# Altium project Med_Prj_ECG.PrjPcb (part 1 of 5)
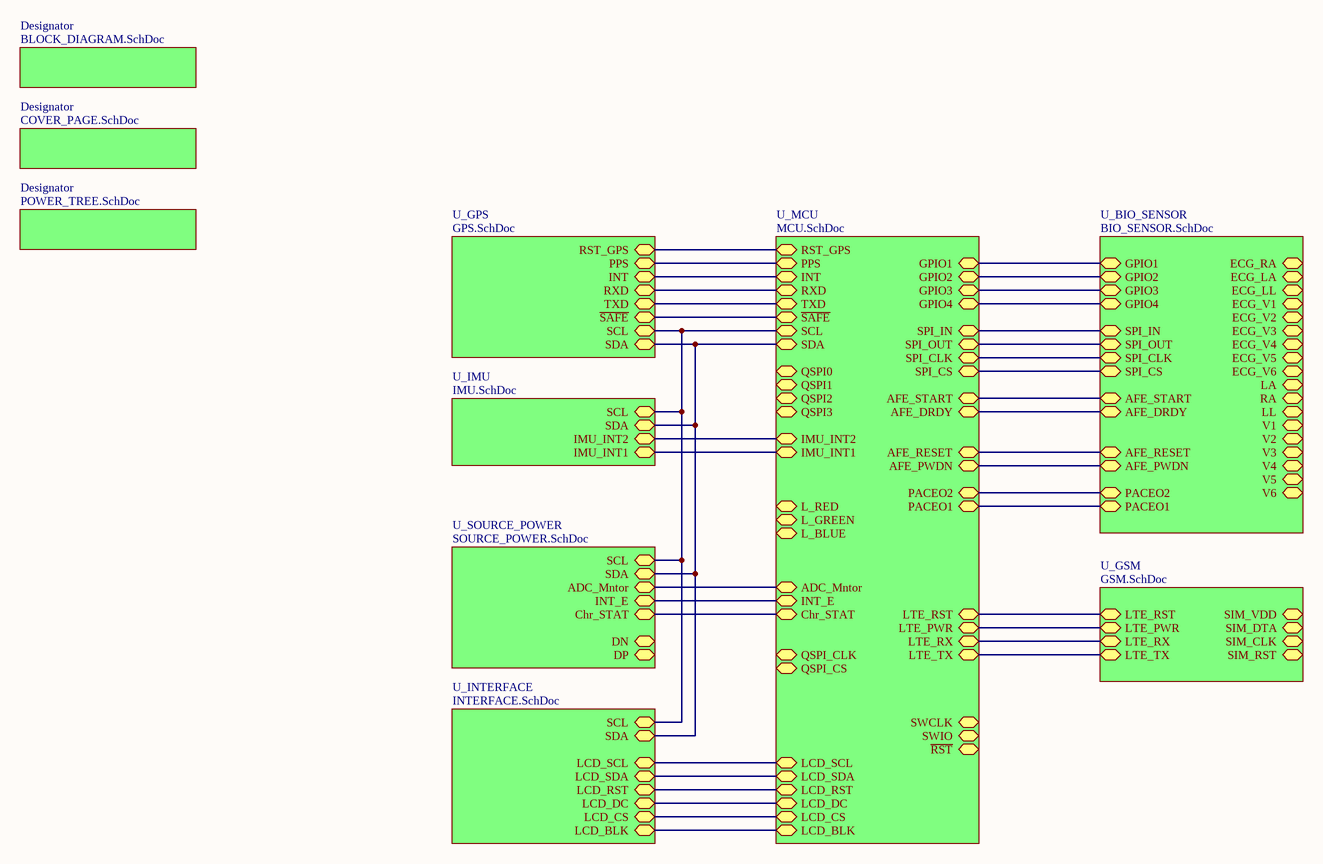
[diagram p0: LINK__PAGE.SchDoc]
12 sheets, 251 parts. Net scope: flat (ports and power ports of the same name join across sheets).
Board files: ECG_Prj_PCB v1.0.PcbDoc, ECG_Prj_PCB_v2.0.PcbDoc
Sheets:
  LINK__PAGE.SchDoc
    Designator = COVER_PAGE.SchDoc
    Designator = BLOCK_DIAGRAM.SchDoc
    U_IMU = IMU.SchDoc
    U_SOURCE_POWER = SOURCE_POWER.SchDoc
    U_GPS = GPS.SchDoc
    U_BIO_SENSOR = BIO_SENSOR.SchDoc
    U_INTERFACE = INTERFACE.SchDoc
    U_MCU = MCU.SchDoc
    Designator = POWER_TREE.SchDoc
    U_GSM = GSM.SchDoc
  Sheet1.SchDoc

## Sheet LINK__PAGE.SchDoc
size A3; SheetNumber: 1; SheetTotal: 12

### Sub-sheets
Designator = COVER_PAGE.SchDoc: no entries
Designator = BLOCK_DIAGRAM.SchDoc: no entries
Designator = POWER_TREE.SchDoc: no entries
U_BIO_SENSOR = BIO_SENSOR.SchDoc: GPIO1 (bidir), GPIO2 (bidir), GPIO3 (bidir), GPIO4 (bidir), AFE_DRDY (bidir), SPI_IN (bidir), SPI_OUT (bidir), SPI_CLK (bidir), SPI_CS (bidir), AFE_START (bidir), AFE_RESET (bidir), AFE_PWDN (bidir), ECG_RA (bidir), ECG_LA (bidir), ECG_LL (bidir), ECG_V1 (bidir), ECG_V2 (bidir), ECG_V3 (bidir), ECG_V4 (bidir), ECG_V5 (bidir), ECG_V6 (bidir), V6 (bidir), LA (bidir), LL (bidir), RA (bidir), V1 (bidir), V5 (bidir), V4 (bidir), V2 (bidir), V3 (bidir), PACEO2 (bidir), PACEO1 (bidir)
U_GPS = GPS.SchDoc: SDA (bidir), SCL (bidir), ~{SAFE} (bidir), TXD (bidir), RXD (bidir), INT (bidir), PPS (bidir), RST_GPS (bidir)
U_GSM = GSM.SchDoc: LTE_RST (bidir), LTE_PWR (bidir), LTE_RX (bidir), LTE_TX (bidir), SIM_DTA (bidir), SIM_VDD (bidir), SIM_CLK (bidir), SIM_RST (bidir)
U_IMU = IMU.SchDoc: IMU_INT1 (bidir), IMU_INT2 (bidir), SDA (bidir), SCL (bidir)
U_INTERFACE = INTERFACE.SchDoc: LCD_BLK (bidir), LCD_CS (bidir), LCD_DC (bidir), LCD_RST (bidir), LCD_SDA (bidir), LCD_SCL (bidir), SDA (bidir), SCL (bidir)
U_MCU = MCU.SchDoc: QSPI1 (bidir), QSPI_CLK (bidir), QSPI0 (bidir), QSPI_CS (bidir), QSPI2 (bidir), QSPI3 (bidir), L_BLUE (bidir), L_RED (bidir), SPI_IN (bidir), SPI_OUT (bidir), SPI_CLK (bidir), AFE_START (bidir), SPI_CS (bidir), GPIO1 (bidir), GPIO2 (bidir), GPIO3 (bidir), GPIO4 (bidir), PACEO2 (bidir), PACEO1 (bidir), AFE_DRDY (bidir), Chr_STAT (bidir), SCL (bidir), SDA (bidir), INT_E (bidir), ADC_Mntor (bidir), L_GREEN (bidir), ~{SAFE} (bidir), TXD (bidir), RXD (bidir), INT (bidir), PPS (bidir), IMU_INT1 (bidir), IMU_INT2 (bidir), SWCLK (bidir), SWIO (bidir), ~{RST} (bidir), LCD_BLK (bidir), LCD_CS (bidir), LCD_DC (bidir), LCD_RST (bidir), LCD_SDA (bidir), LCD_SCL (bidir), RST_GPS (bidir), AFE_RESET (bidir), AFE_PWDN (bidir), LTE_RST (bidir), LTE_PWR (bidir), LTE_RX (bidir), LTE_TX (bidir)
U_SOURCE_POWER = SOURCE_POWER.SchDoc: DP (bidir), DN (bidir), Chr_STAT (bidir), SCL (bidir), SDA (bidir), INT_E (bidir), ADC_Mntor (bidir)

### Nets
(unnamed): sheet U_IMU/IMU_INT1, sheet U_MCU/IMU_INT1
(unnamed): sheet U_IMU/IMU_INT2, sheet U_MCU/IMU_INT2
(unnamed): sheet U_IMU/SDA, sheet U_SOURCE_POWER/SDA, sheet U_GPS/SDA, sheet U_INTERFACE/SDA, sheet U_MCU/SDA
(unnamed): sheet U_IMU/SCL, sheet U_SOURCE_POWER/SCL, sheet U_GPS/SCL, sheet U_INTERFACE/SCL, sheet U_MCU/SCL
(unnamed): sheet U_SOURCE_POWER/Chr_STAT, sheet U_MCU/Chr_STAT
(unnamed): sheet U_SOURCE_POWER/INT_E, sheet U_MCU/INT_E
(unnamed): sheet U_SOURCE_POWER/ADC_Mntor, sheet U_MCU/ADC_Mntor
(unnamed): sheet U_GPS/~{SAFE}, sheet U_MCU/~{SAFE}
(unnamed): sheet U_GPS/TXD, sheet U_MCU/TXD
(unnamed): sheet U_GPS/RXD, sheet U_MCU/RXD
(unnamed): sheet U_GPS/INT, sheet U_MCU/INT
(unnamed): sheet U_GPS/PPS, sheet U_MCU/PPS
(unnamed): sheet U_GPS/RST_GPS, sheet U_MCU/RST_GPS
(unnamed): sheet U_BIO_SENSOR/GPIO1, sheet U_MCU/GPIO1
(unnamed): sheet U_BIO_SENSOR/GPIO2, sheet U_MCU/GPIO2
(unnamed): sheet U_BIO_SENSOR/GPIO3, sheet U_MCU/GPIO3
(unnamed): sheet U_BIO_SENSOR/GPIO4, sheet U_MCU/GPIO4
(unnamed): sheet U_BIO_SENSOR/AFE_DRDY, sheet U_MCU/AFE_DRDY
(unnamed): sheet U_BIO_SENSOR/SPI_IN, sheet U_MCU/SPI_IN
(unnamed): sheet U_BIO_SENSOR/SPI_OUT, sheet U_MCU/SPI_OUT
(unnamed): sheet U_BIO_SENSOR/SPI_CLK, sheet U_MCU/SPI_CLK
(unnamed): sheet U_BIO_SENSOR/SPI_CS, sheet U_MCU/SPI_CS
(unnamed): sheet U_BIO_SENSOR/AFE_START, sheet U_MCU/AFE_START
(unnamed): sheet U_BIO_SENSOR/AFE_RESET, sheet U_MCU/AFE_RESET
(unnamed): sheet U_BIO_SENSOR/AFE_PWDN, sheet U_MCU/AFE_PWDN
(unnamed): sheet U_BIO_SENSOR/PACEO2, sheet U_MCU/PACEO2
(unnamed): sheet U_BIO_SENSOR/PACEO1, sheet U_MCU/PACEO1
(unnamed): sheet U_INTERFACE/LCD_BLK, sheet U_MCU/LCD_BLK
(unnamed): sheet U_INTERFACE/LCD_CS, sheet U_MCU/LCD_CS
(unnamed): sheet U_INTERFACE/LCD_DC, sheet U_MCU/LCD_DC
(unnamed): sheet U_INTERFACE/LCD_RST, sheet U_MCU/LCD_RST
(unnamed): sheet U_INTERFACE/LCD_SDA, sheet U_MCU/LCD_SDA
(unnamed): sheet U_INTERFACE/LCD_SCL, sheet U_MCU/LCD_SCL
(unnamed): sheet U_MCU/LTE_RST, sheet U_GSM/LTE_RST
(unnamed): sheet U_MCU/LTE_PWR, sheet U_GSM/LTE_PWR
(unnamed): sheet U_MCU/LTE_RX, sheet U_GSM/LTE_RX
(unnamed): sheet U_MCU/LTE_TX, sheet U_GSM/LTE_TX

## Sheet COVER_PAGE.SchDoc
size A4; SheetNumber: 2; SheetTotal: 11
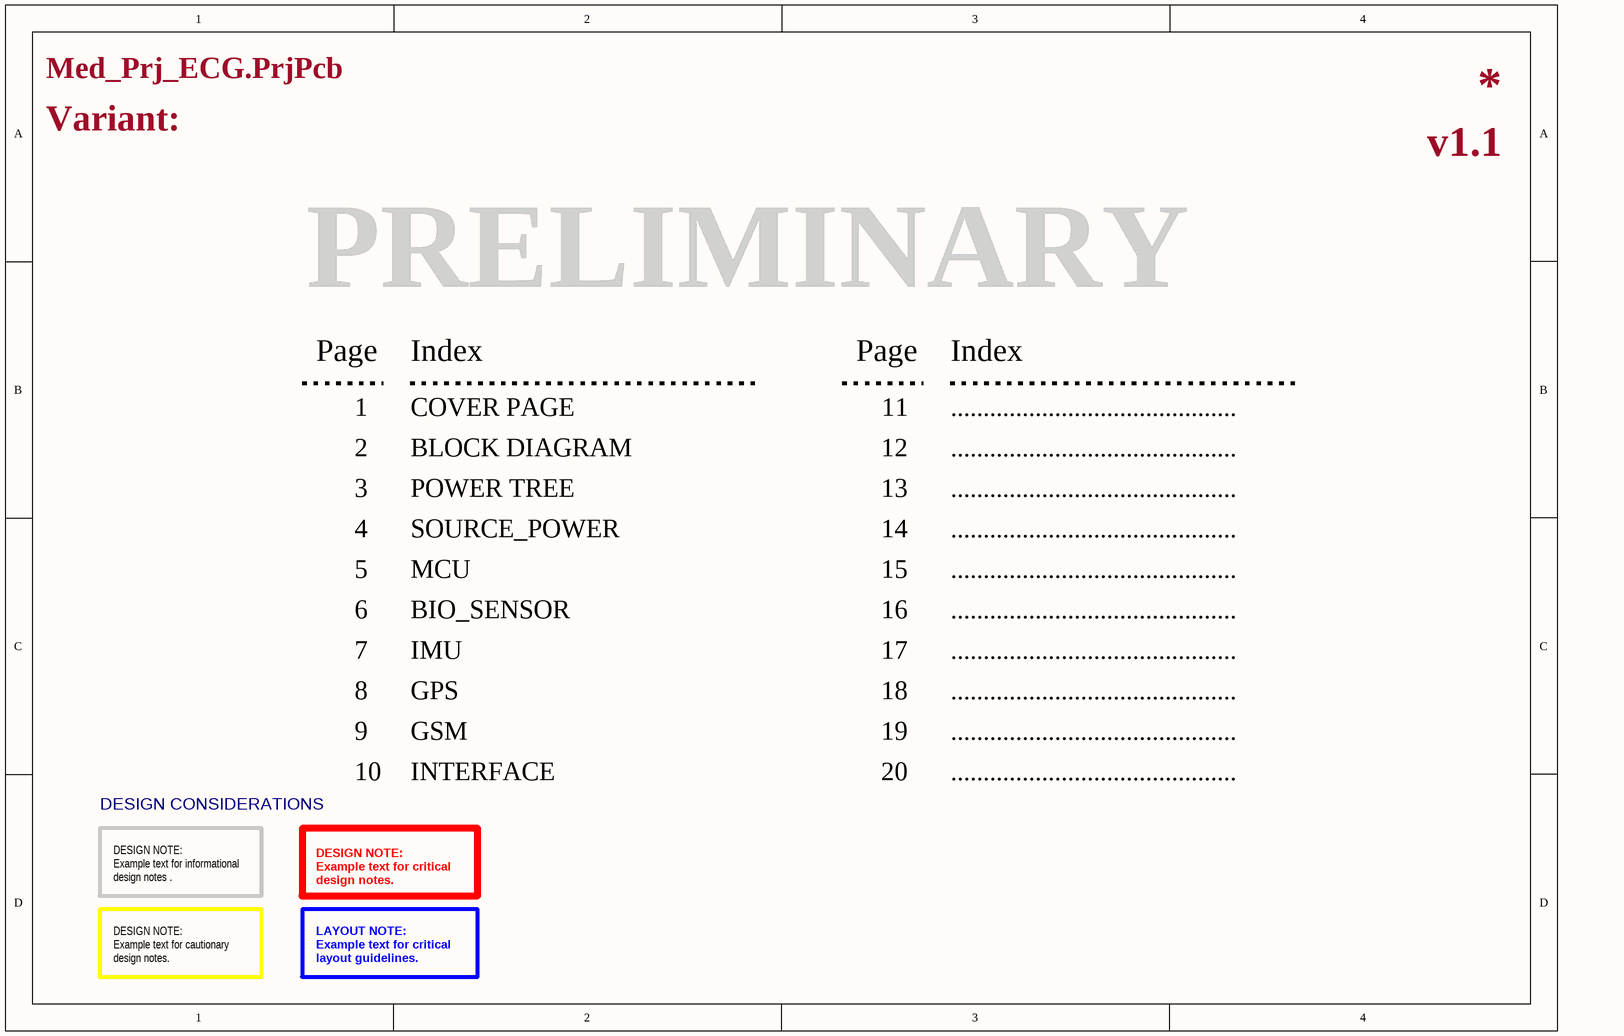
[diagram p1: COVER_PAGE.SchDoc]

### Notes on the sheet
- Variant:
- v1.1
- PRELIMINARY
- Page
- Index
- 1
- COVER PAGE
- 11
- ............................................
- 2
- 3
- BLOCK DIAGRAM
- POWER TREE
- 12
- 13
- 4
- 5
- SOURCE_POWER
- MCU
- 14
- 15
- 6
- BIO_SENSOR
- 16
- 7
- 8
- GPS
- IMU
- 17
- 18
- 9
- 10
- GSM
- INTERFACE
- 19
- 20
- DESIGN CONSIDERATIONS
- DESIGN NOTE:
  Example text for informational
  design notes .
- DESIGN NOTE:
  Example text for critical
  design notes.
- DESIGN NOTE:
  Example text for cautionary
  design notes.
- LAYOUT NOTE:
  Example text for critical
  layout guidelines.

## Sheet BLOCK_DIAGRAM.SchDoc
size A; SheetNumber: 3; SheetTotal: 10
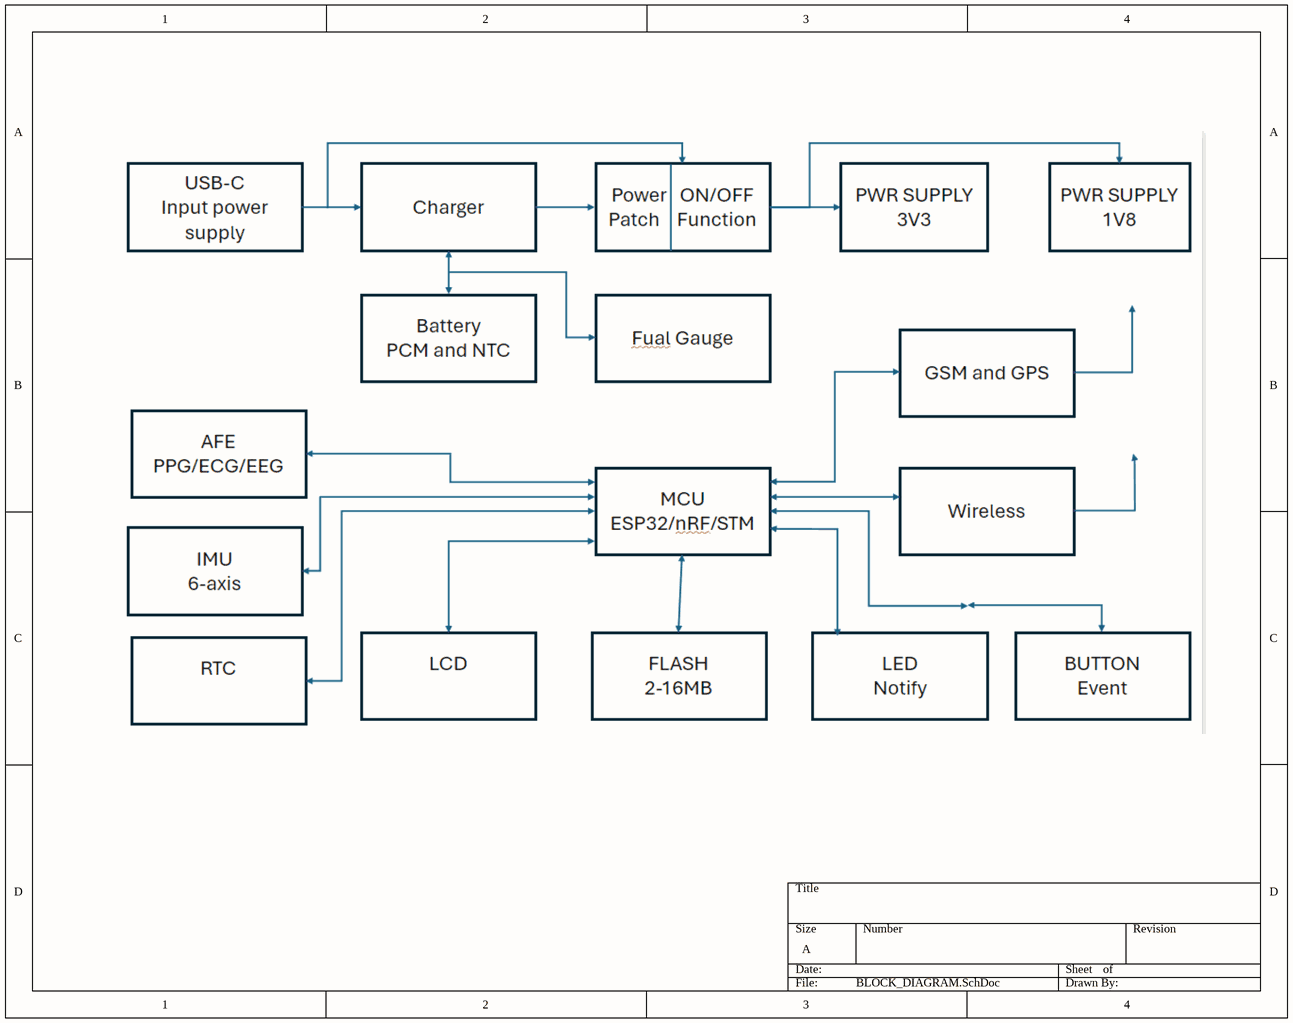
[diagram p2: BLOCK_DIAGRAM.SchDoc]

## Sheet IMU.SchDoc
size A; SheetNumber: 8; SheetTotal: 12
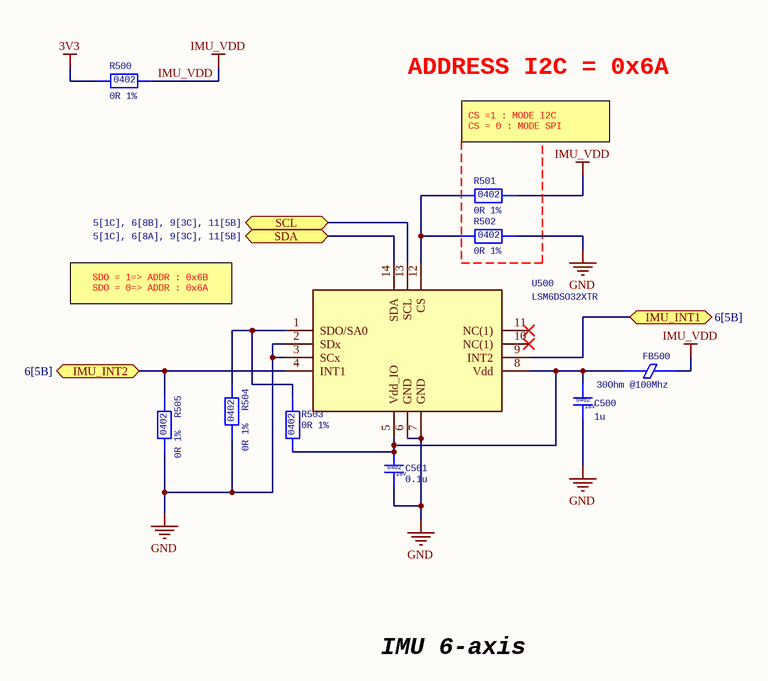
[diagram p3: IMU.SchDoc]

### Parts
C500  1u  [CAP0402]
C501  0.1u  [CAP0402]
FB500  30Ohm @100Mhz  [FB0402]
R500  0R 1%  [RES0402]
R501  0R 1%  [RES0402]
R502  0R 1%  [RES0402]
R503  0R 1%  [RES0402]
R504  0R 1%  [RES0402]
R505  0R 1%  [RES0402]
U500  LSM6DSO32XTR  [LSM6DSO32XTR]

### Ports
IMU_INT1 (bidir, see 6[5B]), IMU_INT2 (bidir, see 6[5B]), SCL (bidir, see 5[1C], 6[8B], 9[3C], 11[5B]), SDA (bidir, see 5[1C], 6[8A], 9[3C], 11[5B])

### Nets
3V3: R500.1
GND: C500.2 C501.2 R502.2 R504.1 R505.1 U500.2(SDx) U500.3(SCx) U500.6(GND) U500.7(GND)
IMU_VDD: FB500.2 R500.2 R501.2
P0.10: U500.9(INT2) ; port IMU_INT1
P0.12: R505.2 U500.4(INT1) ; port IMU_INT2
P1.02: U500.14(SDA) ; port SDA
P1.03: U500.13(SCL) ; port SCL
NetC500_1: C500.1 C501.1 FB500.1 R503.1 U500.5(Vdd_IO) U500.8(Vdd)
NetR501_1: R501.1 R502.1 U500.12(CS)
NetR503_2: R503.2 R504.2 U500.1(SDO/SA0)

Not connected (* = marked no-connect by the designer): U500 10(NC(1))* 11(NC(1))*

### Notes on the sheet
- ADDRESS I2C = 0x6A
- CS =1 : MODE I2C
  CS = 0 : MODE SPI
- SDO = 1=> ADDR : 0x6B
  SDO = 0=> ADDR : 0x6A
- IMU 6-axis

### Library data of the parts
C500 = C_0402_1u: Ceramic Capacitor, Multilayer, Ceramic, 16V, 10% +Tol, 10% -Tol, X5R, 15% TC, 1uF, Surface Mount, 0402; Manufacturer: Taiyo Yuden; Manufacturer Part Number: EMK105BJ105KV-F; Multilayer: Yes; Supplier: Digikey; Supplier Part Number: 587-2477-1-ND; RoHS: Yes; Category: Ceramic Capacitors; Stock: 2709915; Pricing: 1=0.1, 10=0.045, 50=0.031, 100=0.0266, 500=0.01912, 1000=0.01682, 2500=0.01437, 5000=0.01289 (USD); Mounting Technology: Surface Mount; Pins: 2; Dielectric Material: Ceramic; Package Shape: Rectangular; Case/Package: 0402; Terminal Finish: Nickel; Min Operating Temperature: -55°C; Max Operating Temperature: 85°C; JESD-609 Code: e3; Value: 1uF; Capacitor Type: Ceramic; Tolerance  (fill in as +-): 10%; Package Style: SMTMeter; Packaging: Tape and Reel; Tolerance (fill in as +-): 10%; Rated DC Voltage (URdc): 16V; Temperature Characteristics Code: X5R; Termination: Wraparound; Length: 1mm; Width: 0.5mm; Height: 0.5mm; Reach SVHC Compliant: Yes; RoHS Compliant: Yes; ComponentLink1URL: https://datasheet.ciiva.com:443/pdfs/VipMasterIC/IC/TAIY/TAIY-S-A0009096450/TAIY-S-A0009096597-1.pdf?src-supplier=IHS+Markit; ComponentLink1Description: https://datasheet.ciiva.com:443/pdfs/VipMasterIC/IC/TAIY/TAIY-S-A0009096450/TAIY-S-A0009096597-1.pdf?src-supplier=IHS+Markit; ComponentLink2URL: https://datasheet.ciiva.com/134/emk105bj105kv-f-ss-134209.pdf?src-supplier=Digikey; ComponentLink2Description: https://datasheet.ciiva.com/134/emk105bj105kv-f-ss-134209.pdf?src-supplier=Digikey; ComponentLink3URL: https://datasheet.ciiva.com/15920/964emk105bj105kv-f-15920402.pdf?src-supplier=Onlinecomponents.com; ComponentLink3Description: https://datasheet.ciiva.com/15920/964emk105bj105kv-f-15920402.pdf?src-supplier=Onlinecomponents.com; ComponentLink4URL: https://datasheet.ciiva.com/26871/getdatasheetpartid-638287-26871289.pdf?src-supplier=Verical; ComponentLink4Description: https://datasheet.ciiva.com/26871/getdatasheetpartid-638287-26871289.pdf?src-supplier=Verical; ComponentLink5URL: https://datasheet.ciiva.com/30259/265emk105bj105kv-f-30259872.pdf?src-supplier=Onlinecomponents.com; ComponentLink5Description: https://datasheet.ciiva.com/30259/265emk105bj105kv-f-30259872.pdf?src-supplier=Onlinecomponents.com; ComponentLink6URL: https://datasheet.ciiva.com/7657/1497285-7657320.pdf?src-supplier=Element14; ComponentLink6Description: https://datasheet.ciiva.com/7657/1497285-7657320.pdf?src-supplier=Element14; ComponentLink7URL: https://datasheet.ciiva.com/22694/1497285-22694239.pdf?src-supplier=Element14; ComponentLink7Description: https://datasheet.ciiva.com/22694/1497285-22694239.pdf?src-supplier=Element14; ComponentLink8URL: https://datasheet.ciiva.com/5424/mlcc01-e-5424190.pdf?src-supplier=Mouser; ComponentLink8Description: https://datasheet.ciiva.com/5424/mlcc01-e-5424190.pdf?src-supplier=Mouser
C501 = C_0402_0.1u: Ceramic Capacitor, Multilayer, Ceramic, 16V, 10% +Tol, 10% -Tol, X7R, 15% TC, 0.1uF, Surface Mount, 0402; Manufacturer: Murata; Manufacturer Part Number: GRM155R71C104KA88J; Value: 100nF; Multilayer: Yes; Supplier: Digikey; Supplier Part Number: 490-6328-1-ND; RoHS: Yes; Category: Ceramic Capacitors; Stock: 19409569; Pricing: 1=0.1, 10=0.019, 50=0.011, 100=0.0086, 500=0.00646, 1000=0.00508, 2500=0.00462, 5000=0.00425 (USD); Mounting Technology: Surface Mount; Pins: 2; Dielectric Material: Ceramic; Package Shape: Rectangular; Case/Package: 0402; Terminal Finish: Nickel; Min Operating Temperature: -55°C; Max Operating Temperature: 125°C; JESD-609 Code: e3; Capacitor Type: Ceramic; Tolerance  (fill in as +-): 10%; Package Style: SMTMeter; Packaging: Tape and Reel; Tolerance (fill in as +-): 10%; Rated DC Voltage (URdc): 16V; Temperature Characteristics Code: X7R; Termination: Wraparound; Length: 1mm; Width: 0.5mm; Height: 0.5mm; Reach SVHC Compliant: Yes; RoHS Compliant: Yes; ComponentLink1URL: https://psearch.en.murata.com:443/capacitor/product/GRM155R71C104KA88%23.pdf?src-supplier=IHS+Markit; ComponentLink1Description: https://psearch.en.murata.com:443/capacitor/product/GRM155R71C104KA88%23.pdf?src-supplier=IHS+Markit; ComponentLink2URL: https://datasheet.ciiva.com/6271/product-6271168.pdf?src-supplier=Digikey; ComponentLink2Description: https://datasheet.ciiva.com/6271/product-6271168.pdf?src-supplier=Digikey; ComponentLink3URL: https://datasheet.ciiva.com/6271/grm155r71c104ka88-01-6271231.pdf?src-supplier=Digikey; ComponentLink3Description: https://datasheet.ciiva.com/6271/grm155r71c104ka88-01-6271231.pdf?src-supplier=Digikey
FB500 = BLM15PD300SN1D: Ferrite Chip, 1 Function(s), 1.4A, 2 Pin(s); Manufacturer: Murata; DC Resistance-Max: 35mR; Clock Frequency: 100MHz; Channels: 1; Output Impedance: 30R; Supplier 1: Digikey; Supplier Part Number 1: 490-5200-1-ND; Supplier: Digikey; Supplier Part Number: 490-5200-6-ND; Manufacturer Part Number: BLM15PD300SN1D; RoHS: Yes; Category: Ferrite Beads and Chips; Stock: 1685; Pricing: 1=0.1, 10=0.054, 25=0.0468, 50=0.042, 100=0.0376, 250=0.03236, 500=0.02884, 1000=0.02561, 5000=0.01905 (USD); Mounting Technology: Surface Mount; Material: Ferrite; Case Code: 0402; Terminal Finish: Tin; Min Operating Temperature: -55°C; Max Operating Temperature: 125°C; JESD-609 Code: e3; Construction: Chip Bead; Filter Type: FERRITE CHIP; Min Frequency: 100MHz; Packaging: Tape and Reel; Current Rating: 1.4A; Length: 1mm; Width: 0.5mm; Height: 0.5mm; Reach SVHC Compliant: Yes; RoHS Compliant: Yes; ComponentLink1URL: https://datasheet.ciiva.com:443/pdfs/VipMasterIC/IC/MURE/MURE-S-A0010009827/MURE-S-A0010009827-1.pdf?src-supplier=IHS+Markit; ComponentLink1Description: https://datasheet.ciiva.com:443/pdfs/VipMasterIC/IC/MURE/MURE-S-A0010009827/MURE-S-A0010009827-1.pdf?src-supplier=IHS+Markit; ComponentLink2URL: https://datasheet.ciiva.com/3854/l0110s0100blm15p-3854117.pdf?src-supplier=Arrow+Electronics; ComponentLink2Description: https://datasheet.ciiva.com/3854/l0110s0100blm15p-3854117.pdf?src-supplier=Arrow+Electronics; ComponentLink3URL: https://datasheet.ciiva.com/18093/getdatasheetpartid-150173-18093043.pdf?src-supplier=Verical; ComponentLink3Description: https://datasheet.ciiva.com/18093/getdatasheetpartid-150173-18093043.pdf?src-supplier=Verical; ComponentLink4URL: https://datasheet.ciiva.com/41425/001171687-da-01-en-chip-drossel0402-30r-2200ma-1-0x0-5mm-41425790.pdf?src-supplier=Conrad; ComponentLink4Description: https://datasheet.ciiva.com/41425/001171687-da-01-en-chip-drossel0402-30r-2200ma-1-0x0-5mm-41425790.pdf?src-supplier=Conrad; ComponentLink5URL: https://datasheet.ciiva.com/41449/001172206-da-01-en-drossel-0402-30r-21-0x0-5mm-10000st-41449493.pdf?src-supplier=Conrad; ComponentLink5Description: https://datasheet.ciiva.com/41449/001172206-da-01-en-drossel-0402-30r-21-0x0-5mm-10000st-41449493.pdf?src-supplier=Conrad; ComponentLink6URL: https://datasheet.ciiva.com/14122/blm-series-eng-tds-14122923.pdf?src-supplier=Distrelec; ComponentLink6Description: https://datasheet.ciiva.com/14122/blm-series-eng-tds-14122923.pdf?src-supplier=Distrelec; ComponentLink7URL: https://datasheet.ciiva.com/1012/l0110e-1012431.pdf?src-supplier=Digikey; ComponentLink7Description: https://datasheet.ciiva.com/1012/l0110e-1012431.pdf?src-supplier=Digikey; ComponentLink8URL: https://datasheet.ciiva.com/1012/l0110e-1012432.pdf?src-supplier=Digikey; ComponentLink8Description: https://datasheet.ciiva.com/1012/l0110e-1012432.pdf?src-supplier=Digikey; ComponentLink9URL: https://datasheet.ciiva.com/1012/l0110e-1012433.pdf?src-supplier=Digikey; ComponentLink9Description: https://datasheet.ciiva.com/1012/l0110e-1012433.pdf?src-supplier=Digikey
R500-R505 = R_0402_0R: Metal Glaze/thick Film, 0.0625W, 0ohm, Surface Mount, 0402; Manufacturer: Yageo; Manufacturer Part Number: RC0402JR-070RL; Power: 62.5mW; Rated Temperature: 70°C; Package Height: 0.35mm; Package Length: 1mm; Package Width: 0.5mm; Supplier 1: Digikey; Supplier Part Number 1: 311-0.0JRTR-ND; Supplier: Digikey; Supplier Part Number: 311-0.0JRCT-ND; RoHS: Yes; Category: Chip SMD Resistors; Stock: 14877447; Pricing: 1=0.1, 10=0.011, 25=0.0084, 50=0.0064, 100=0.0045, 250=0.00364, 500=0.0029, 1000=0.00214, 5000=0.00154, 10000=0.00133, 30000=0.00117, 50000=0.00107, 100000=0.00105 (USD); Mounting Technology: Surface Mount; Pins: 2; Package Shape: Rectangular; Case/Package: 0402; Terminal Finish: Nickel; Min Operating Temperature: -55°C; Max Operating Temperature: 155°C; JESD-609 Code: e3; Resistor Type: FIXED RESISTOR; Packaging: Tape and Reel; Value: 0R; Technology: METAL GLAZE/THICK FILM; Termination: Wraparound; Construction: Chip; Package Style: SMTMeter; Reach SVHC Compliant: Yes; RoHS Compliant: Yes; ComponentLink1URL: https://datasheet.ciiva.com:443/pdfs/VipMasterIC/IC/YAGO/YAGO-S-A0008145938/YAGO-S-A0008145938-1.pdf?src-supplier=IHS+Markit; ComponentLink1Description: https://datasheet.ciiva.com:443/pdfs/VipMasterIC/IC/YAGO/YAGO-S-A0008145938/YAGO-S-A0008145938-1.pdf?src-supplier=IHS+Markit; ComponentLink2URL: https://datasheet.ciiva.com/2452/pyu-rc0402-51-rohs-l-6-2452608.pdf?src-supplier=Digikey; ComponentLink2Description: https://datasheet.ciiva.com/2452/pyu-rc0402-51-rohs-l-6-2452608.pdf?src-supplier=Digikey; ComponentLink3URL: https://datasheet.ciiva.com/11808/0900766b80c66297-11808195.pdf?src-supplier=Rs; ComponentLink3Description: https://datasheet.ciiva.com/11808/0900766b80c66297-11808195.pdf?src-supplier=Rs; ComponentLink4URL: https://datasheet.ciiva.com/7983/1018594-7983535.pdf?src-supplier=Element14; ComponentLink4Description: https://datasheet.ciiva.com/7983/1018594-7983535.pdf?src-supplier=Element14; ComponentLink5URL: https://datasheet.ciiva.com/22747/1018594-22747515.pdf?src-supplier=Element14; ComponentLink5Description: https://datasheet.ciiva.com/22747/1018594-22747515.pdf?src-supplier=Element14; ComponentLink6URL: https://datasheet.ciiva.com/2452/pyu-r-int-thick-7-2452609.pdf?src-supplier=Digikey; ComponentLink6Description: https://datasheet.ciiva.com/2452/pyu-r-int-thick-7-2452609.pdf?src-supplier=Digikey; ComponentLink7URL: https://datasheet.ciiva.com/2452/pyu-r-int-thick-7-2452610.pdf?src-supplier=Digikey; ComponentLink7Description: https://datasheet.ciiva.com/2452/pyu-r-int-thick-7-2452610.pdf?src-supplier=Digikey; ComponentLink8URL: https://datasheet.ciiva.com/8896/pyu-rc0402-51-rohs-l-6-8896201.pdf?src-supplier=Avnet; ComponentLink8Description: https://datasheet.ciiva.com/8896/pyu-rc0402-51-rohs-l-6-8896201.pdf?src-supplier=Avnet
U500 = LSM6DSO32XTR: Analog Circuit; Manufacturer: STMicroelectronics; Supplier 1: Digikey; Supplier Part Number 1: 497-LSM6DSO32XTRCT-ND; Supplier: Digikey; Supplier Part Number: 497-LSM6DSO32XTRCT-ND; Manufacturer Part Number: LSM6DSO32XTR; RoHS: Yes; Category: Linear ICs; Stock: 7272; Pricing: 1=6.51, 5=5.488, 10=5.1, 25=4.628, 50=4.3008, 100=3.9969, 500=3.37188, 1000=3.13396 (USD)